# EAGLE design C64 24-28 ROM Adapter (EAGLE 9.6.1)
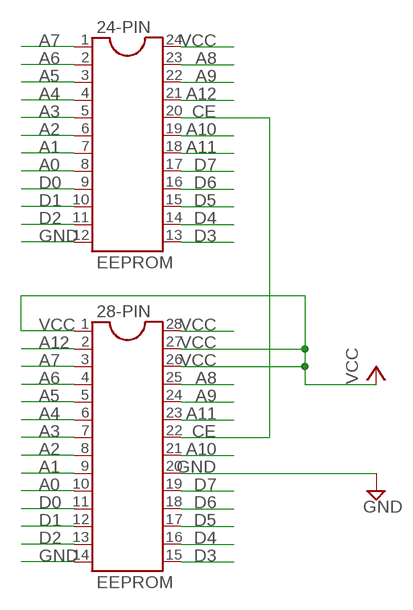
[diagram p0: schematic, sheet 1]

## Parts
24-PIN  EEPROM  DIL24-4  [DIL24-4]
28-PIN  EEPROM  DIL28-4  [DIL28-4]

## Nets
A0: 24-PIN.8 28-PIN.10
A1: 24-PIN.7 28-PIN.9
A2: 24-PIN.6 28-PIN.8
A3: 24-PIN.5 28-PIN.7
A4: 24-PIN.4 28-PIN.6
A5: 24-PIN.3 28-PIN.5
A6: 24-PIN.2 28-PIN.4
A7: 24-PIN.1 28-PIN.3
A8: 24-PIN.23 28-PIN.25
A9: 24-PIN.22 28-PIN.24
A10: 24-PIN.19 28-PIN.21
A11: 24-PIN.18 28-PIN.23
A12: 24-PIN.21 28-PIN.2
CE: 24-PIN.20 28-PIN.22
D0: 24-PIN.9 28-PIN.11
D1: 24-PIN.10 28-PIN.12
D2: 24-PIN.11 28-PIN.13
D3: 24-PIN.13 28-PIN.15
D4: 24-PIN.14 28-PIN.16
D5: 24-PIN.15 28-PIN.17
D6: 24-PIN.16 28-PIN.18
D7: 24-PIN.17 28-PIN.19
GND: 24-PIN.12 28-PIN.14 28-PIN.20
VCC: 24-PIN.24 28-PIN.1 28-PIN.26 28-PIN.27 28-PIN.28

## Library data of the parts
24-PIN = ic-package:DIL24: Dual In Line
28-PIN = ic-package:DIL28: Dual In Line

## Board
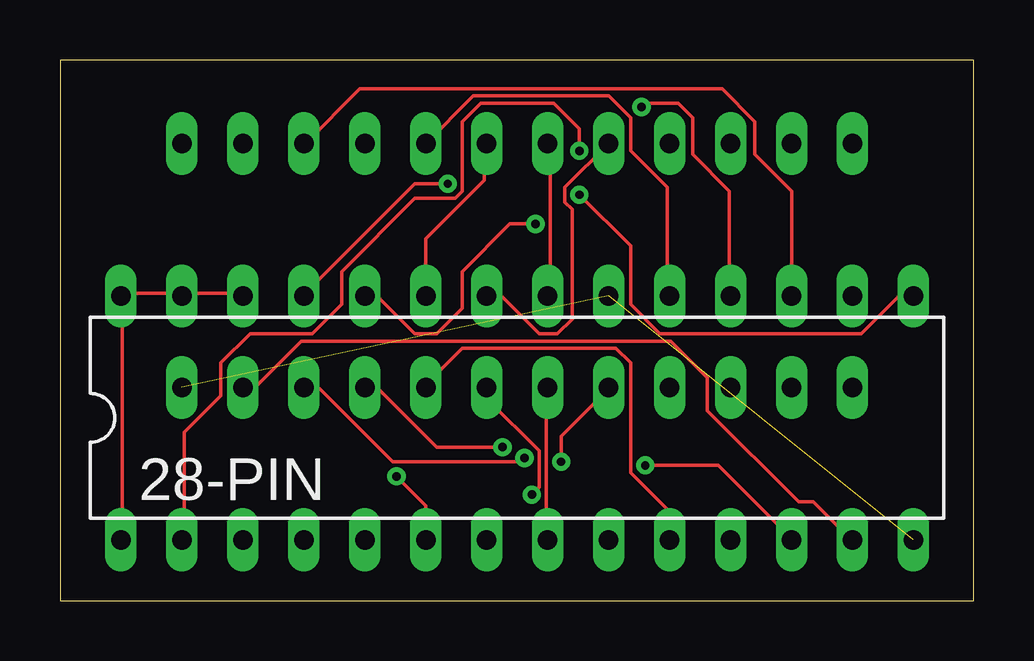
[diagram p1: board, top side]
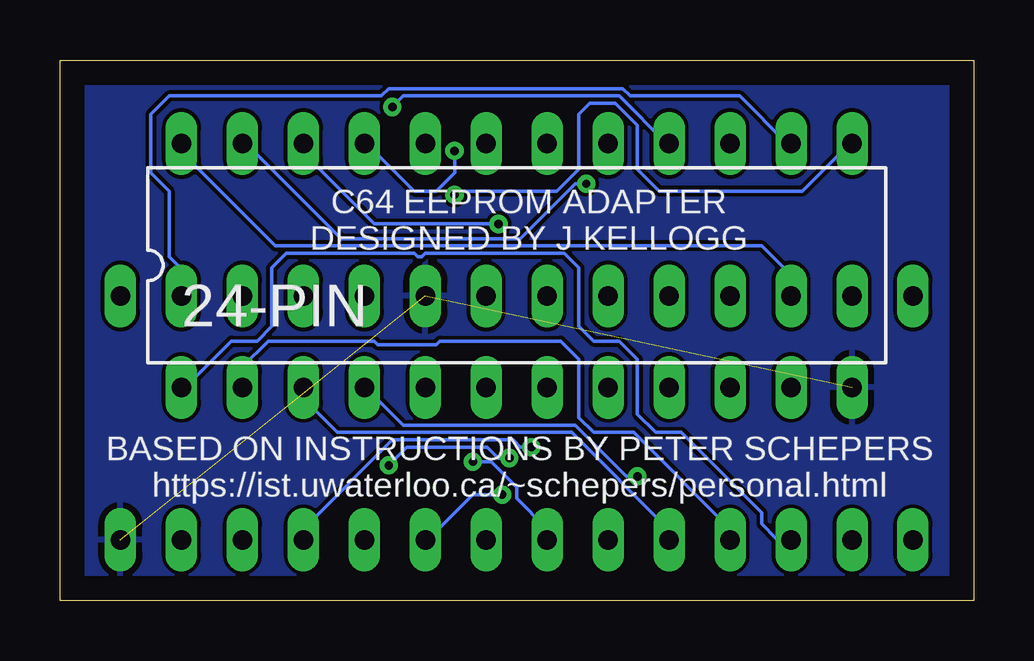
[diagram p2: board, bottom side, seen from below]

Size 38.08 x 22.53 mm. Coordinates in mm from the lower left corner, seen from the top.
Outline: 0,0 38.08,0 38.08,22.53 0,22.53 0,0
Copper layers (1*16): Top 0.035mm / dielectric 1.5mm / Bottom 0.035mm
Design rules "default": minimum track width 6mil, minimum drill 0.35mm, track to track 6mil, track to pad 6mil, pad to pad 6mil, via to via 6mil, smd to smd 6mil, copper to edge 40mil, drill to drill 6mil, minimum pad ring 10mil, minimum via ring 8mil, stop-mask expansion 4mil, vias tented up to drill 0mil, thermal gap 10mil

### Footprints (pad centres in the part's own frame; a part is rotated, then mirrored left to right if it is on the bottom)
DIL24-4 = drill 0.813 long: 1 -13.97,-5.08; 2 -11.43,-5.08; 3 -8.89,-5.08; 4 -6.35,-5.08; 5 -3.81,-5.08; 6 -1.27,-5.08; 7 1.27,-5.08; 8 3.81,-5.08; 9 6.35,-5.08; 10 8.89,-5.08; 11 11.43,-5.08; 12 13.97,-5.08; 13 13.97,5.08; 14 11.43,5.08; 15 8.89,5.08; 16 6.35,5.08; 17 3.81,5.08; 18 1.27,5.08; 19 -1.27,5.08; 20 -3.81,5.08; 21 -6.35,5.08; 22 -8.89,5.08; 23 -11.43,5.08; 24 -13.97,5.08
DIL28-4 = drill 0.813 long: 1 -16.51,-5.08; 2 -13.97,-5.08; 3 -11.43,-5.08; 4 -8.89,-5.08; 5 -6.35,-5.08; 6 -3.81,-5.08; 7 -1.27,-5.08; 8 1.27,-5.08; 9 3.81,-5.08; 10 6.35,-5.08; 11 8.89,-5.08; 12 11.43,-5.08; 13 13.97,-5.08; 14 16.51,-5.08; 15 16.51,5.08; 16 13.97,5.08; 17 11.43,5.08; 18 8.89,5.08; 19 6.35,5.08; 20 3.81,5.08; 21 1.27,5.08; 22 -1.27,5.08; 23 -3.81,5.08; 24 -6.35,5.08; 25 -8.89,5.08; 26 -11.43,5.08; 27 -13.97,5.08; 28 -16.51,5.08

### Placement (x,y rotation side)
24-PIN  19.05,13.97 0 bottom
28-PIN  19.05,7.62 0 top

### Tracks (layer width: path | path; a pad name or v marks a point on that pad's centre or on a via)
A0
  Top 0.152: 28-PIN.10 25.3,2.59 25.3,3.81 23.77,5.33 23.77,9.91 23.16,10.52 16.76,10.52 15.24,8.99 24-PIN.8
A1  (via drill 0.35)
  Top 0.152: v19.66,4.42 19.96,4.72 19.96,6.25 17.83,8.38 17.83,8.84 24-PIN.7
  Bottom 0.152: v19.66,4.42 20.88,4.42 22.86,2.44 28-PIN.9
A2
  Top 0.152: 28-PIN.8 20.27,2.59 20.27,8.84 24-PIN.6
A3  (via drill 0.35)
  Top 0.152: v20.88,5.79 20.88,6.86 22.86,8.84 24-PIN.5
  Bottom 0.152: v20.88,5.79 20.12,5.79 19.05,4.72 19.05,4.27 17.83,3.05 17.83,2.59 28-PIN.7
A4  (via drill 0.35)
  Top 0.152: 28-PIN.6 15.24,3.96 v14.02,5.18
  Bottom 0.152: v14.02,5.18 14.48,5.18 16.61,7.32 23.77,7.32 25.3,8.84 24-PIN.4
A5
  Bottom 0.152: 28-PIN.5 12.8,2.59 12.8,3.05 16.76,7.01 26.52,7.01 27.89,8.38 27.89,8.84 24-PIN.3
A6
  Bottom 0.152: 24-PIN.2 30.48,9.75 29.41,10.82 24.99,10.82 24.84,10.67 22.4,10.67 22.25,10.82 17.22,10.82 16.46,10.06 16.46,7.62 15.85,7.01 14.17,7.01 10.21,3.05 10.21,2.59 28-PIN.4
A7
  Bottom 0.152: 28-PIN.3 7.62,2.59 8.23,2.59 8.84,3.2 8.84,3.66 12.19,7.01 13.26,7.01 14.02,7.77 14.02,10.06 14.78,10.82 15.85,10.82 16.46,11.43 16.46,13.87 17.07,14.48 22.86,14.48 23.01,14.33 23.16,14.33 23.32,14.48 28.65,14.48 29.26,13.87 29.26,11.43 29.87,10.82 30.94,10.82 32.92,8.84 24-PIN.1
A8  (via drill 0.35)
  Top 0.152: v16.15,17.37 14.78,17.37 10.21,12.8 28-PIN.25
  Bottom 0.152: v16.15,17.37 16.61,17.37 18.9,15.09 26.36,15.09 30.33,19.05 24-PIN.23
A9  (via drill 0.35)
  Top 0.152: v19.81,15.7 18.75,15.7 16.76,13.72 16.76,12.19 15.7,11.12 14.78,11.12 13.26,12.65 12.8,12.65 28-PIN.24
  Bottom 0.152: v19.81,15.7 24.99,15.7 27.89,18.59 27.89,19.05 24-PIN.22
A10
  Top 0.152: 28-PIN.21 20.42,12.8 20.42,19.05 24-PIN.19
A11
  Top 0.152: 28-PIN.23 15.24,15.09 17.68,17.53 17.68,19.05 24-PIN.18
A12  (via drill 0.35)
  Top 0.152: v21.64,18.75 21.64,19.66 20.57,20.73 17.53,20.73 16.76,19.96 16.76,17.07 16.46,16.76 14.78,16.76 11.73,13.72 11.73,12.34 10.52,11.12 7.92,11.12 6.71,9.91 6.71,8.53 5.18,7.01 5.18,2.59 28-PIN.2
  Bottom 0.152: v21.64,18.75 21.64,17.83 22.4,17.07 23.32,17.07 25.3,19.05 24-PIN.21
CE
  Top 0.152: 24-PIN.20 21.03,17.22 21.03,16.61 21.34,16.31 21.34,11.73 20.73,11.12 19.96,11.12 18.44,12.65 17.83,12.65 28-PIN.22
D0  (via drill 0.35)
  Top 0.152: v18.44,6.4 15.7,6.4 13.26,8.84 12.8,8.84 24-PIN.9
  Bottom 0.152: v18.44,6.4 18.9,6.4 19.2,6.71 24.23,6.71 27.89,3.05 27.89,2.59 28-PIN.11
D1  (via drill 0.35)
  Top 0.152: v19.36,5.94 19.2,5.79 13.87,5.79 10.82,8.84 10.21,8.84 24-PIN.10 | v24.38,5.64 27.43,5.64 30.48,2.59 28-PIN.12
  Bottom 0.152: v19.36,5.94 19.81,5.94 20.27,6.4 23.62,6.4 v24.38,5.64
D2
  Top 0.152: 24-PIN.11 7.62,8.99 8.23,8.99 10.06,10.82 25.45,10.82 26.98,9.3 26.98,7.92 30.79,4.12 31.39,4.12 32.92,2.59 28-PIN.13
D3  (via drill 0.35)
  Top 0.152: v21.64,16.92 23.77,14.78 23.77,12.34 24.99,11.12 33.38,11.12 34.9,12.65 35.51,12.65 28-PIN.15
  Bottom 0.152: v21.64,16.92 21.49,17.07 17.37,17.07 16.46,17.98 16.46,20.27 16,20.73 14.94,20.73 14.02,19.81 14.02,17.98 13.11,17.07 7.16,17.07 5.18,19.05 24-PIN.13
D4
  Bottom 0.152: 24-PIN.14 7.77,19.05 9.75,21.03 14.33,21.03 14.63,21.34 24.38,21.34 24.69,21.03 33.53,21.03 34.29,20.27 34.29,17.83 33.53,17.07 33.53,14.33 33.07,13.87 33.07,12.8 28-PIN.16
D5
  Top 0.152: 28-PIN.17 30.48,17.07 28.96,18.59 28.96,19.96 27.58,21.34 12.5,21.34 10.21,19.05 24-PIN.15
D6  (via drill 0.35)
  Top 0.152: v24.23,20.57 24.38,20.73 25.76,20.73 26.36,20.12 26.36,18.59 27.89,17.07 27.89,12.8 28-PIN.18
  Bottom 0.152: v24.23,20.57 23.77,21.03 14.78,21.03 12.8,19.05 24-PIN.16
D7
  Top 0.152: 24-PIN.17 17.22,21.03 22.86,21.03 23.77,20.12 23.77,18.75 25.3,17.22 25.3,12.8 28-PIN.19
GND  (2 unrouted)
  pour Bottom (isolate 0): 0,0 38.1,0 38.1,22.86 0,22.86
VCC
  Top 0.152: 28-PIN.1 2.59,2.59 2.59,12.65 28-PIN.28 2.59,12.8 5.03,12.8 28-PIN.27 5.18,12.8 7.62,12.8 28-PIN.26
  Bottom 0.152: 28-PIN.26 7.62,13.56 8.84,14.78 29.11,14.78 32.92,18.59 32.92,19.05 24-PIN.24

### Text on the board
bPlace: C64 EEPROM ADAPTER / DESIGNED BY J KELLOGG | BASED ON INSTRUCTIONS BY PETER SCHEPERS / https://ist.uwaterloo.ca/~schepers/personal.html
bNames: 24-PIN